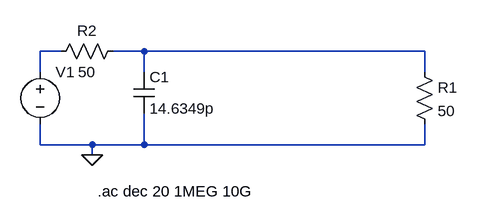
[diagram p0: schematic Lowpass.asc]
Lowpass.asc, the LTspice schematic file:
Version 4
SHEET 1 880 680
WIRE -608 112 -640 112
WIRE -480 112 -528 112
WIRE -48 112 -480 112
WIRE -640 144 -640 112
WIRE -480 144 -480 112
WIRE -48 144 -48 112
WIRE -640 256 -640 224
WIRE -560 256 -640 256
WIRE -480 256 -480 208
WIRE -480 256 -560 256
WIRE -48 256 -48 224
WIRE -48 256 -480 256
WIRE -560 272 -560 256
FLAG -560 272 0
SYMBOL res -64 128 R0
SYMATTR InstName R1
SYMATTR Value 50
SYMBOL res -512 96 R90
WINDOW 0 0 56 VBottom 2
WINDOW 3 32 56 VTop 2
SYMATTR InstName R2
SYMATTR Value 50
SYMBOL cap -496 144 R0
SYMATTR InstName C1
SYMATTR Value 14.6349p
SYMBOL voltage -640 128 R0
SYMATTR InstName V1
SYMATTR Value ""
SYMATTR Value2 AC 1
TEXT -552 328 Left 2 !.ac dec 20 1MEG 10G

The netlist it stands for:
* Lowpass.asc
R1 N002 0 50
R2 N002 N001 50
C1 N002 0 14.6349p
V1 N001 0 AC 1
.ac dec 20 1MEG 10G
.backanno
.end